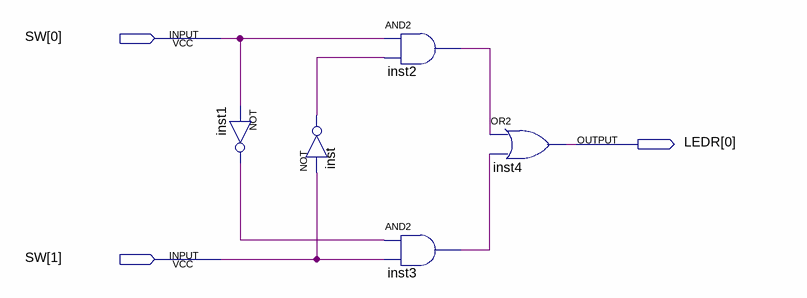
[diagram p0: schematic sheet]
// Quartus schematic light_shcematic.bdf as structural Verilog: 5 symbols, 3 pins
module light_shcematic (
  input  [1:0] SW,
  output [0:0] LEDR
);

  wire inst1_out, inst2_out, inst3_out, inst_out;

  not inst1 (inst1_out, SW[0]);
  not inst (inst_out, SW[1]);
  and inst2 (inst2_out, SW[0], inst_out);
  and inst3 (inst3_out, inst1_out, SW[1]);
  or inst4 (LEDR[0], inst2_out, inst3_out);
endmodule
